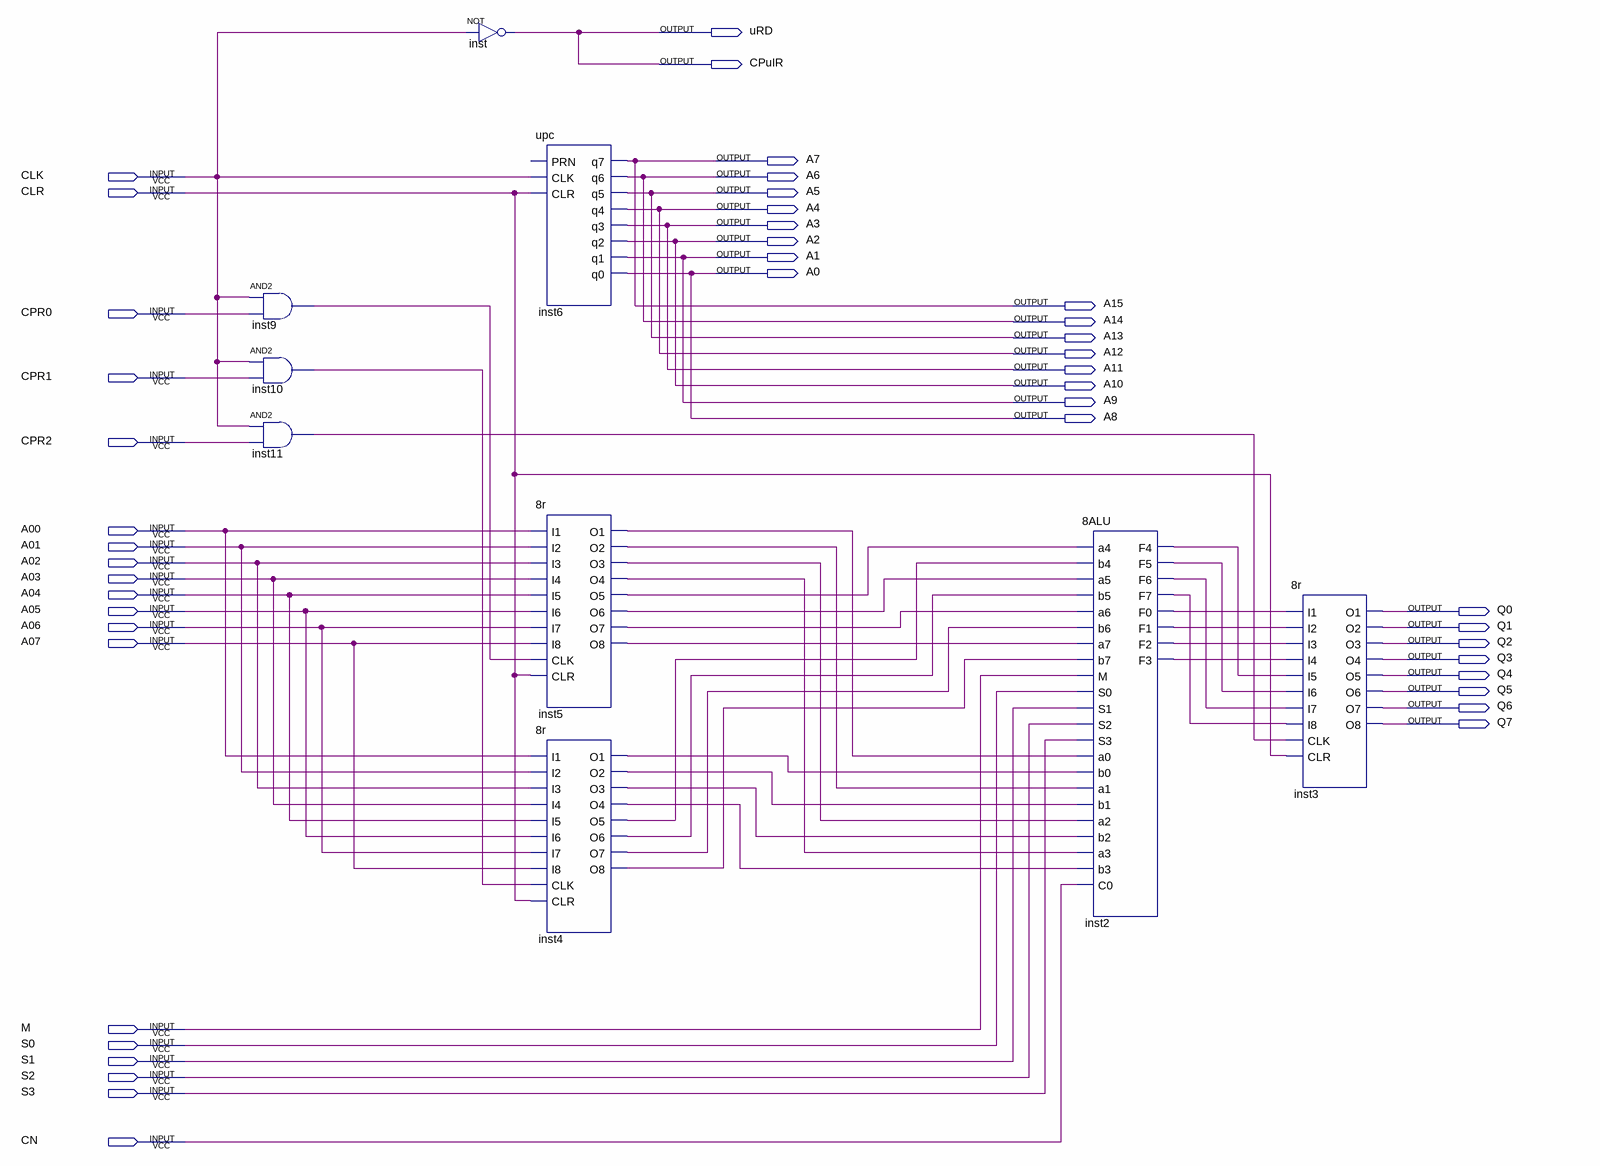
[diagram p0: schematic sheet]
// Quartus schematic final3.bdf as structural Verilog: 9 symbols, 45 pins
module final3 (
  input  CLK,
  input  CLR,
  input  CPR0,
  input  CPR1,
  input  CPR2,
  input  A00,
  input  A01,
  input  A02,
  input  A03,
  input  A04,
  input  A05,
  input  A06,
  input  A07,
  input  M,
  input  S0,
  input  S1,
  input  S2,
  input  S3,
  input  CN,
  output uRD,
  output CPuIR,
  output A7,
  output A6,
  output A5,
  output A4,
  output A3,
  output A2,
  output A1,
  output A0,
  output A15,
  output A14,
  output A13,
  output A12,
  output A11,
  output A10,
  output A9,
  output A8,
  output Q0,
  output Q1,
  output Q2,
  output Q3,
  output Q4,
  output Q5,
  output Q6,
  output Q7
);

  wire inst2_f0, inst2_f1, inst2_f2, inst2_f3, inst2_f4, inst2_f5, inst2_f6, inst2_f7, inst4_o1, inst4_o2,
       inst4_o3, inst4_o4, inst4_o5, inst4_o6, inst4_o7, inst4_o8, inst5_o1, inst5_o2, inst5_o3, inst5_o4,
       inst5_o5, inst5_o6, inst5_o7, inst5_o8, inst9_out, inst10_out, inst11_out;

  and inst9 (inst9_out, CLK, CPR0);
  and inst10 (inst10_out, CLK, CPR1);
  and inst11 (inst11_out, CLK, CPR2);
  not inst (CPuIR, CLK);
  upc inst6 (
    .CLK(CLK), .CLR(CLR), .q7(A7), .q6(A6), .q5(A5), .q4(A4), .q3(A3), .q2(A2), .q1(A1), .q0(A0));  // open: PRN
  \8r  inst5 (
    .I1(A00), .I2(A01), .I3(A02), .I4(A03), .I5(A04), .I6(A05), .I7(A06), .I8(A07), .CLK(inst9_out),
    .CLR(CLR), .O1(inst5_o1), .O2(inst5_o2), .O3(inst5_o3), .O4(inst5_o4), .O5(inst5_o5), .O6(inst5_o6),
    .O7(inst5_o7), .O8(inst5_o8));
  \8r  inst4 (
    .I1(A00), .I2(A01), .I3(A02), .I4(A03), .I5(A04), .I6(A05), .I7(A06), .I8(A07), .CLK(inst10_out),
    .CLR(CLR), .O1(inst4_o1), .O2(inst4_o2), .O3(inst4_o3), .O4(inst4_o4), .O5(inst4_o5), .O6(inst4_o6),
    .O7(inst4_o7), .O8(inst4_o8));
  \8ALU  inst2 (
    .a4(inst5_o5), .b4(inst4_o5), .a5(inst5_o6), .b5(inst4_o6), .a6(inst5_o7), .b6(inst4_o7), .a7(inst5_o8),
    .b7(inst4_o8), .M(M), .S0(S0), .S1(S1), .S2(S2), .S3(S3), .a0(inst5_o1), .b0(inst4_o1), .a1(inst5_o2),
    .b1(inst4_o2), .a2(inst5_o3), .b2(inst4_o3), .a3(inst5_o4), .b3(inst4_o4), .C0(CN), .F4(inst2_f4),
    .F5(inst2_f5), .F6(inst2_f6), .F7(inst2_f7), .F0(inst2_f0), .F1(inst2_f1), .F2(inst2_f2), .F3(inst2_f3));
  \8r  inst3 (
    .I1(inst2_f0), .I2(inst2_f1), .I3(inst2_f2), .I4(inst2_f3), .I5(inst2_f4), .I6(inst2_f5), .I7(inst2_f6),
    .I8(inst2_f7), .CLK(inst11_out), .CLR(CLR), .O1(Q0), .O2(Q1), .O3(Q2), .O4(Q3), .O5(Q4), .O6(Q5),
    .O7(Q6), .O8(Q7));

  assign A8 = A0;
  assign A9 = A1;
  assign A10 = A2;
  assign A11 = A3;
  assign A12 = A4;
  assign A13 = A5;
  assign A14 = A6;
  assign A15 = A7;
  assign uRD = CPuIR;
endmodule
